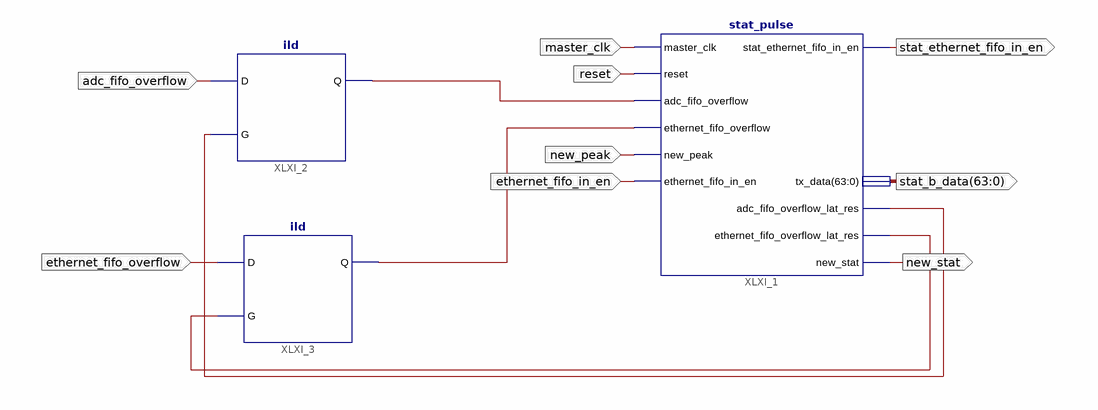
[diagram p0: schematic sheet 1]
// Xilinx ISE schematic stat_pulse_module.sch (virtex4) as structural Verilog: 3 symbols, 9 ports
module stat_pulse_module (
  input  master_clk,
  input  adc_fifo_overflow,
  input  ethernet_fifo_overflow,
  input  reset,
  input  new_peak,
  input  ethernet_fifo_in_en,
  output stat_ethernet_fifo_in_en,
  output [63:0] stat_b_data,
  output new_stat
);

  wire XLXN_7, XLXN_8, XLXN_19, XLXN_21;

  stat_pulse XLXI_1 (
    .master_clk(master_clk), .reset(reset), .adc_fifo_overflow(XLXN_7), .ethernet_fifo_overflow(XLXN_8),
    .new_peak(new_peak), .ethernet_fifo_in_en(ethernet_fifo_in_en), .adc_fifo_overflow_lat_res(XLXN_19),
    .ethernet_fifo_overflow_lat_res(XLXN_21), .stat_ethernet_fifo_in_en(stat_ethernet_fifo_in_en),
    .tx_data(stat_b_data), .new_stat(new_stat));
  ild XLXI_2 (.D(adc_fifo_overflow), .G(XLXN_19), .Q(XLXN_7));
  ild XLXI_3 (.D(ethernet_fifo_overflow), .G(XLXN_21), .Q(XLXN_8));
endmodule
